# EAGLE schematic ig-normal-ver10 (EAGLE 9.6.2)
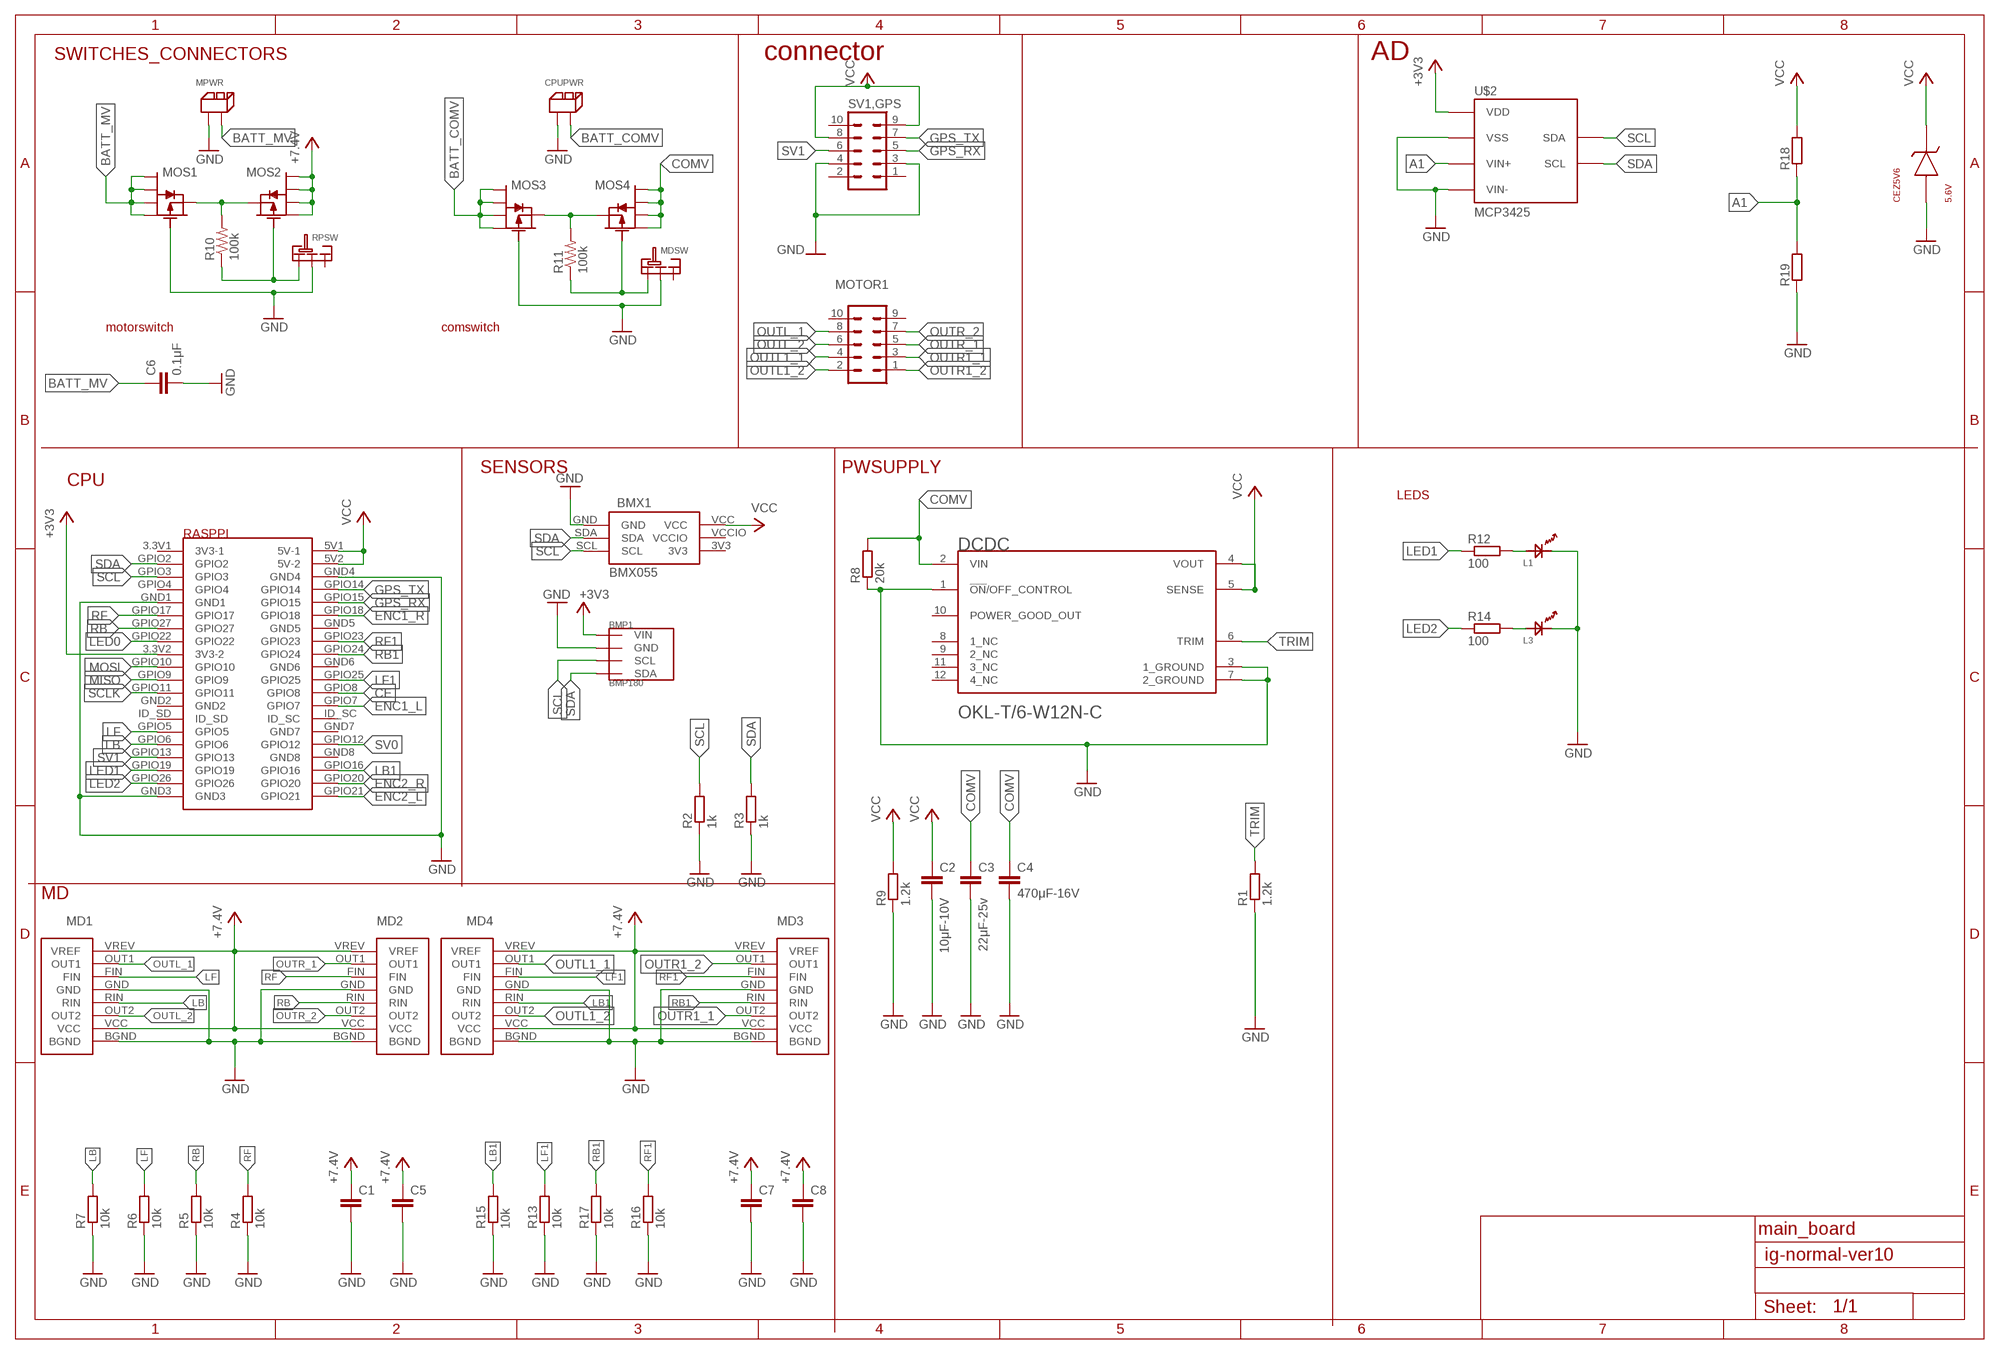
[diagram p0: schematic, sheet 1]

## Parts
BMP1  BMP180  [GY-68]
BMX1  BMX055  [BMX055]
C1  C-EUC0603  [C0603]
C2  10μF-10V  C-EUC0603  [C0603]
C3  22μF-25v  C-EUC0805  [C0805]
C4  470μF-16V  C-EUC0603  [C0603]
C5  C-EUC0603  [C0603]
C6  0.1μF  C-EUC0603  [C0603]
C7  C-EUC0603  [C0603]
C8  C-EUC0603  [C0603]
CEZ5V6  5.6V  CEZ5V6  [CEZ5V6]
CPUPWR  2PIN  [2PIN]
DCDC  OKL-T/6-W12N-CMURATA_OKL-T-6-W12N-C_0_0  [MURATA_OKL-T-6-W12N-C_0]
L1  OSXX1608C1A  [OSXX1608C1A]
L3  OSXX1608C1A  [OSXX1608C1A]
MD1  BD6222HFP-TR  [BD6222HFP-TR]
MD2  BD6222HFP-TR  [BD6222HFP-TR]
MD3  BD6222HFP-TR  [BD6222HFP-TR]
MD4  BD6222HFP-TR  [BD6222HFP-TR]
MDSW  SRIDE_SWITCH  [SRIDE_SWITCH]
MOS1  PCH_SSM6J808R  [SSM6J808R]
MOS2  PCH_SSM6J808R  [SSM6J808R]
MOS3  PCH_SSM6J808R  [SSM6J808R]
MOS4  PCH_SSM6J808R  [SSM6J808R]
MOTOR1  ML10L  [ML10L]
MPWR  2PIN  [2PIN]
R1  1.2k  R-EU_R0805  [R0805]
R2  1k  R-EU_R0603  [R0603]
R3  1k  R-EU_R0603  [R0603]
R4  10k  R-EU_R0603  [R0603]
R5  10k  R-EU_R0603  [R0603]
R6  10k  R-EU_R0603  [R0603]
R7  10k  R-EU_R0603  [R0603]
R8  20k  R-EU_R0603  [R0603]
R9  1.2k  R-EU_R0805  [R0805]
R10  100k  R-US_R0603  [R0603]
R11  100k  R-US_R0603  [R0603]
R12  100  R-EU_R0603  [R0603]
R13  10k  R-EU_R0603  [R0603]
R14  100  R-EU_R0603  [R0603]
R15  10k  R-EU_R0603  [R0603]
R16  10k  R-EU_R0603  [R0603]
R17  10k  R-EU_R0603  [R0603]
R18  R-EU_R0603  [R0603]
R19  R-EU_R0603  [R0603]
RASPPI  RASPBERYPIZEROW  [RASPBERYPIZEROW]
RPSW  SRIDE_SWITCH  [SRIDE_SWITCH]
SV1,GPS  ML10L  [ML10L]
U$2  MCP3425  [SOT23-6]

## Nets
+3V3 [PWR]: BMP1.P1(VIN) RASPPI.3.3V2(3V3-2) U$2.5(VDD)
+5V [PWR]: C1.1 C5.1 C7.1 C8.1 MD1.VCC MD1.VREV(VREF) MD2.VCC MD2.VREV(VREF) MD3.VCC MD3.VREV(VREF) MD4.VCC MD4.VREV(VREF) MOS2.1 MOS2.2 MOS2.5 MOS2.6 ; supply symbol labelled +7.4V
A1: R18.1 R19.2 U$2.1(VIN+)
BATT_COMV [PWR]: CPUPWR.P$2 MOS3.1 MOS3.2 MOS3.5 MOS3.6
BATT_MV [PWR]: C6.1 MOS1.1 MOS1.2 MOS1.5 MOS1.6 MPWR.P$2
CE: RASPPI.GPIO8
COMV [PWR]: C3.1 C4.1 DCDC.2(VIN) MOS4.1 MOS4.2 MOS4.5 MOS4.6 R8.2
ENC1_L: RASPPI.GPIO7
ENC1_R: RASPPI.GPIO18
ENC2_L: RASPPI.GPIO21
ENC2_R: RASPPI.GPIO20
GND [mospwr]: BMP1.P2(GND) BMX1.GND C1.2 C2.2 C3.2 C4.2 C5.2 C6.2 C7.2 C8.2 CEZ5V6.P$1 CPUPWR.P$1 DCDC.1(!ON!/OFF_CONTROL) DCDC.3(1_GROUND) DCDC.7(2_GROUND) L1.CT L3.CT MD1.BGND MD1.GND MD2.BGND MD2.GND MD3.BGND MD3.GND MD4.BGND MD4.GND MDSW.LR MOS1.3 MOS3.3 MPWR.P$1 R1.1 R2.1 R3.1 R4.1 R5.1 R6.1 R7.1 R8.1 R9.1 R13.1 R15.1 R16.1 R17.1 R19.1 RASPPI.GND1 RASPPI.GND3 RASPPI.GND4 RPSW.LR SV1,GPS.3 SV1,GPS.4
GPS_RX: RASPPI.GPIO15 SV1,GPS.5
GPS_TX: RASPPI.GPIO14 SV1,GPS.7
LB: MD1.RIN R7.2 RASPPI.GPIO6
LB1: MD4.RIN R15.2 RASPPI.GPIO16
LED0: RASPPI.GPIO22
LED1: R12.1 RASPPI.GPIO19
LED2: R14.1 RASPPI.GPIO26
LF: MD1.FIN R6.2 RASPPI.GPIO5
LF1: MD4.FIN R13.2 RASPPI.GPIO25
MISO: RASPPI.GPIO9
MOSI: RASPPI.GPIO10
N$1 [mospwr]: MOS3.4 MOS4.4 R11.2
N$2 [mospwr]: MDSW.L MOS4.3 R11.1
N$3: L1.AN R12.2
N$5: L3.AN R14.2
N$6 [mospwr]: MOS1.4 MOS2.4 R10.2
N$7 [mospwr]: MOS2.3 R10.1 RPSW.L
OUTL1_1: MD4.OUT1 MOTOR1.4
OUTL1_2: MD4.OUT2 MOTOR1.2
OUTL_1: MD1.OUT1 MOTOR1.8
OUTL_2: MD1.OUT2 MOTOR1.6
OUTR1_1: MD3.OUT2 MOTOR1.3
OUTR1_2: MD3.OUT1 MOTOR1.1
OUTR_1: MD2.OUT1 MOTOR1.5
OUTR_2: MD2.OUT2 MOTOR1.7
RB: MD2.RIN R5.2 RASPPI.GPIO27
RB1: MD3.RIN R17.2 RASPPI.GPIO24
RF: MD2.FIN R4.2 RASPPI.GPIO17
RF1: MD3.FIN R16.2 RASPPI.GPIO23
SCL: BMP1.P3(SCL) BMX1.SCL R2.2 RASPPI.GPIO3 U$2.4(SDA)
SCLK: RASPPI.GPIO11
SDA: BMP1.P4(SDA) BMX1.SDA R3.2 RASPPI.GPIO2 U$2.3(SCL)
SV0: RASPPI.GPIO12
SV1: RASPPI.GPIO13 SV1,GPS.6
TRIM: DCDC.6(TRIM) R1.2
VCC [PWR]: BMX1.VCC C2.1 CEZ5V6.P$2 DCDC.4(VOUT) DCDC.5(SENSE) R9.2 R18.2 RASPPI.5V1(5V-1) RASPPI.5V2(5V-2) SV1,GPS.8 SV1,GPS.9
VSS: U$2.2(VSS) U$2.6(VIN-) ; supply symbol labelled GND
Unconnected: DCDC.8(1_NC) DCDC.9(2_NC) DCDC.10(POWER_GOOD_OUT) DCDC.11(3_NC) DCDC.12(4_NC) MDSW.R MOTOR1.9 MOTOR1.10 RASPPI.3.3V1(3V3-1) RASPPI.GND2 RASPPI.GND5 RASPPI.GND6 RASPPI.GND7 RASPPI.GND8 RASPPI.GPIO4 RASPPI.ID_SC RASPPI.ID_SD RPSW.R SV1,GPS.1 SV1,GPS.2 SV1,GPS.10

## Notes on the sheet
- SWITCHES_CONNECTORS | connector | AD
- motorswitch | comswitch
- SENSORS | PWSUPPLY
- CPU
- LEDS
- MD
- main_board

## Power pins joined to a net without a drawn wire
3V3: BMX1.3V3
VCCIO: BMX1.VCCIO

## Library data of the parts
BMP1 = BMP180:BMP180
BMX1 = BMX055:BMX055
C1-C8 = rcl:C-EU: CAPACITOR, European symbol; SPICEPREFIX: C
CEZ5V6 = CEZXVX:CEZ5V6
CPUPWR MPWR = XR Connector:2PIN
DCDC = OKL-T_6-W12N-C:OKL-T/6-W12N-C: Non-Isolated PoL Module DC DC Converter 1 Output 0.591 ~ 5.5V - - 6A 4.5V - 14V Input; AUTOMOTIVE: No; CENTROID_NOT_SPECIFIED: No; DATASHEET: https://www.murata.com/en-us/products/productdetail.aspx?partno=OKL-T/6-W12N-C; DEVICE_CLASS_L1: Integrated Circuits (ICs); DEVICE_CLASS_L2: Power Management ICs; DEVICE_CLASS_L3: Voltage Regulators - Switching; DIGIKEY_DESCRIPTION: DC DC CONVERTER 0.591-5.5V 30W; DIGIKEY_PART_NUMBER: 811-2214-1-ND; FOOTPRINT_VARIANT_NAME_0: Recommended_Land_Pattern; HEIGHT: 7.2mm; LEAD_FREE: Yes; MAX_SUPPLY_VOLTAGE: 14V; MF: Murata; MFG_PACKAGE_IDENT: OKL-T/6-W12; MFG_PACKAGE_IDENT_COMPONENT_ID: 4873da16363307f0; MFG_PACKAGE_IDENT_DATE: 0; MFG_PACKAGE_IDENT_REV: 0; MIN_SUPPLY_VOLTAGE: 4.5V; MOUSER_DESCRIPTION: Non-Isolated DC/DC Converters 12Vin .59-5.5Vout 6A 30W Neg Polarity; MOUSER_PART_NUMBER: 580-OKL-T/6-W12N-C; MPN: OKL-T/6-W12N-C; NOMINAL_SUPPLY_CURRENT: 20mA; NUMBER_OF_OUTPUTS: 1; OUTPUT_CURRENT: 6A; OUTPUT_TYPE: AdjustableProgrammable; OUTPUT_VOLTAGE: 0.591-5.5V; PACKAGE: iLGA12; PREFIX: MD; ROHS: Yes; SWITCHING_FREQUENCY: 600kHz; SWITCHING_TOPOLOGY: Buck; TEMPERATURE_RANGE_HIGH: +85°C; TEMPERATURE_RANGE_LOW: -40°C; VERIFICATION_VERSION: 0.0.0.3
L1 L3 = Chip LED:OSXX1608C1A
MD1-MD4 = BD6222HFP-TR:BD6222HFP-TR
MDSW RPSW = Sride Switch:SRIDE_SWITCH
MOS1-MOS4 = Chip MOSFET:PCH_SSM6J808R
MOTOR1 SV1,GPS = con-ml:ML10L: HARTING; OC_FARNELL: unknown; OC_NEWARK: unknown
R1-R9 R12-R19 = rcl:R-EU_: RESISTOR, European symbol; SPICEPREFIX: R
R10 R11 = rcl:R-US_: RESISTOR, American symbol; SPICEPREFIX: R
RASPPI = RaspberyPiZeroW:RASPBERYPIZEROW
U$2 = bt:MCP3425: Microchip MCP3425 ADC The MCP3425 is a single channel low-noise, high accuracy ?? A/D converter with differential inputs and up to 16 bits of resolution in a small SOT-23-6 package. The on-board precision 2.048V reference voltage enables an input range of ±2.048V differentially (? voltage = 4.096V). The device uses a two-wire I2C compatible serial interface and operates from a single 2.7V to 5.5V power supply. The MCP3425 device performs conversion at rates of 15, 60, or 240 samples per second (SPS) depending on the user controllable configuration bit settings using the two-wire I2C serial interface Reference: http://ww1.microchip.com/downloads/en/DeviceDoc/22072a.pdf

## Net classes
1 PWR: width 0.8 mm, clearance 0.1 mm
2 mospwr: width 0.45 mm